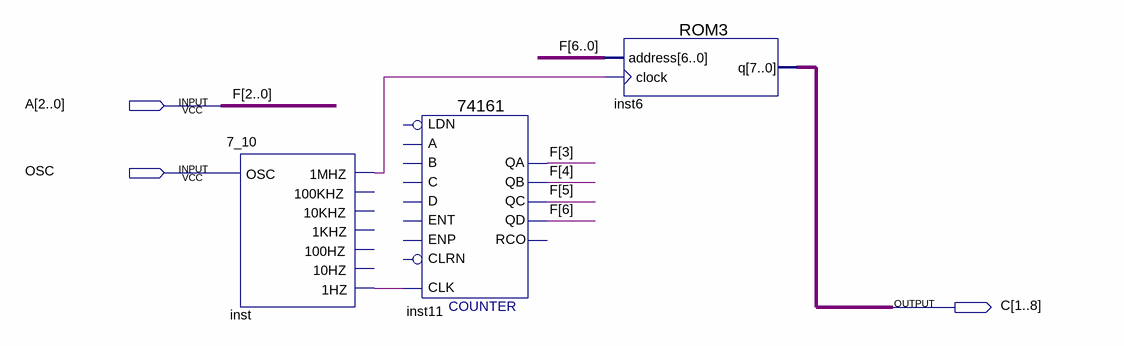
[diagram p0: schematic sheet]
// Quartus schematic FLASH.bdf as structural Verilog: 3 symbols, 3 pins
module FLASH (
  input  [2:0] A,
  input  OSC,
  output [1:8] C
);

  wire inst_1hz, inst_1mhz;
  wire [6:3] F;

  \7_10  inst (.OSC(OSC), .\1MHZ (inst_1mhz), .\1HZ (inst_1hz));  // open: 100KHZ, 10KHZ, 1KHZ, 100HZ, 10HZ
  \74161  inst11 (
    .CLK(inst_1hz), .QD(F[6]), .QC(F[5]), .QB(F[4]), .QA(F[3]));  // open: CLRN, ENP, LDN, A, D, ENT, B, C, RCO
  ROM3 inst6 (.address({F, A}), .clock(inst_1mhz), .q(C));

  // Other names for the same wires on the sheet: F[2:0] = A
endmodule
